# Altium project WR_NIC.PrjPcb (part 1 of 6)
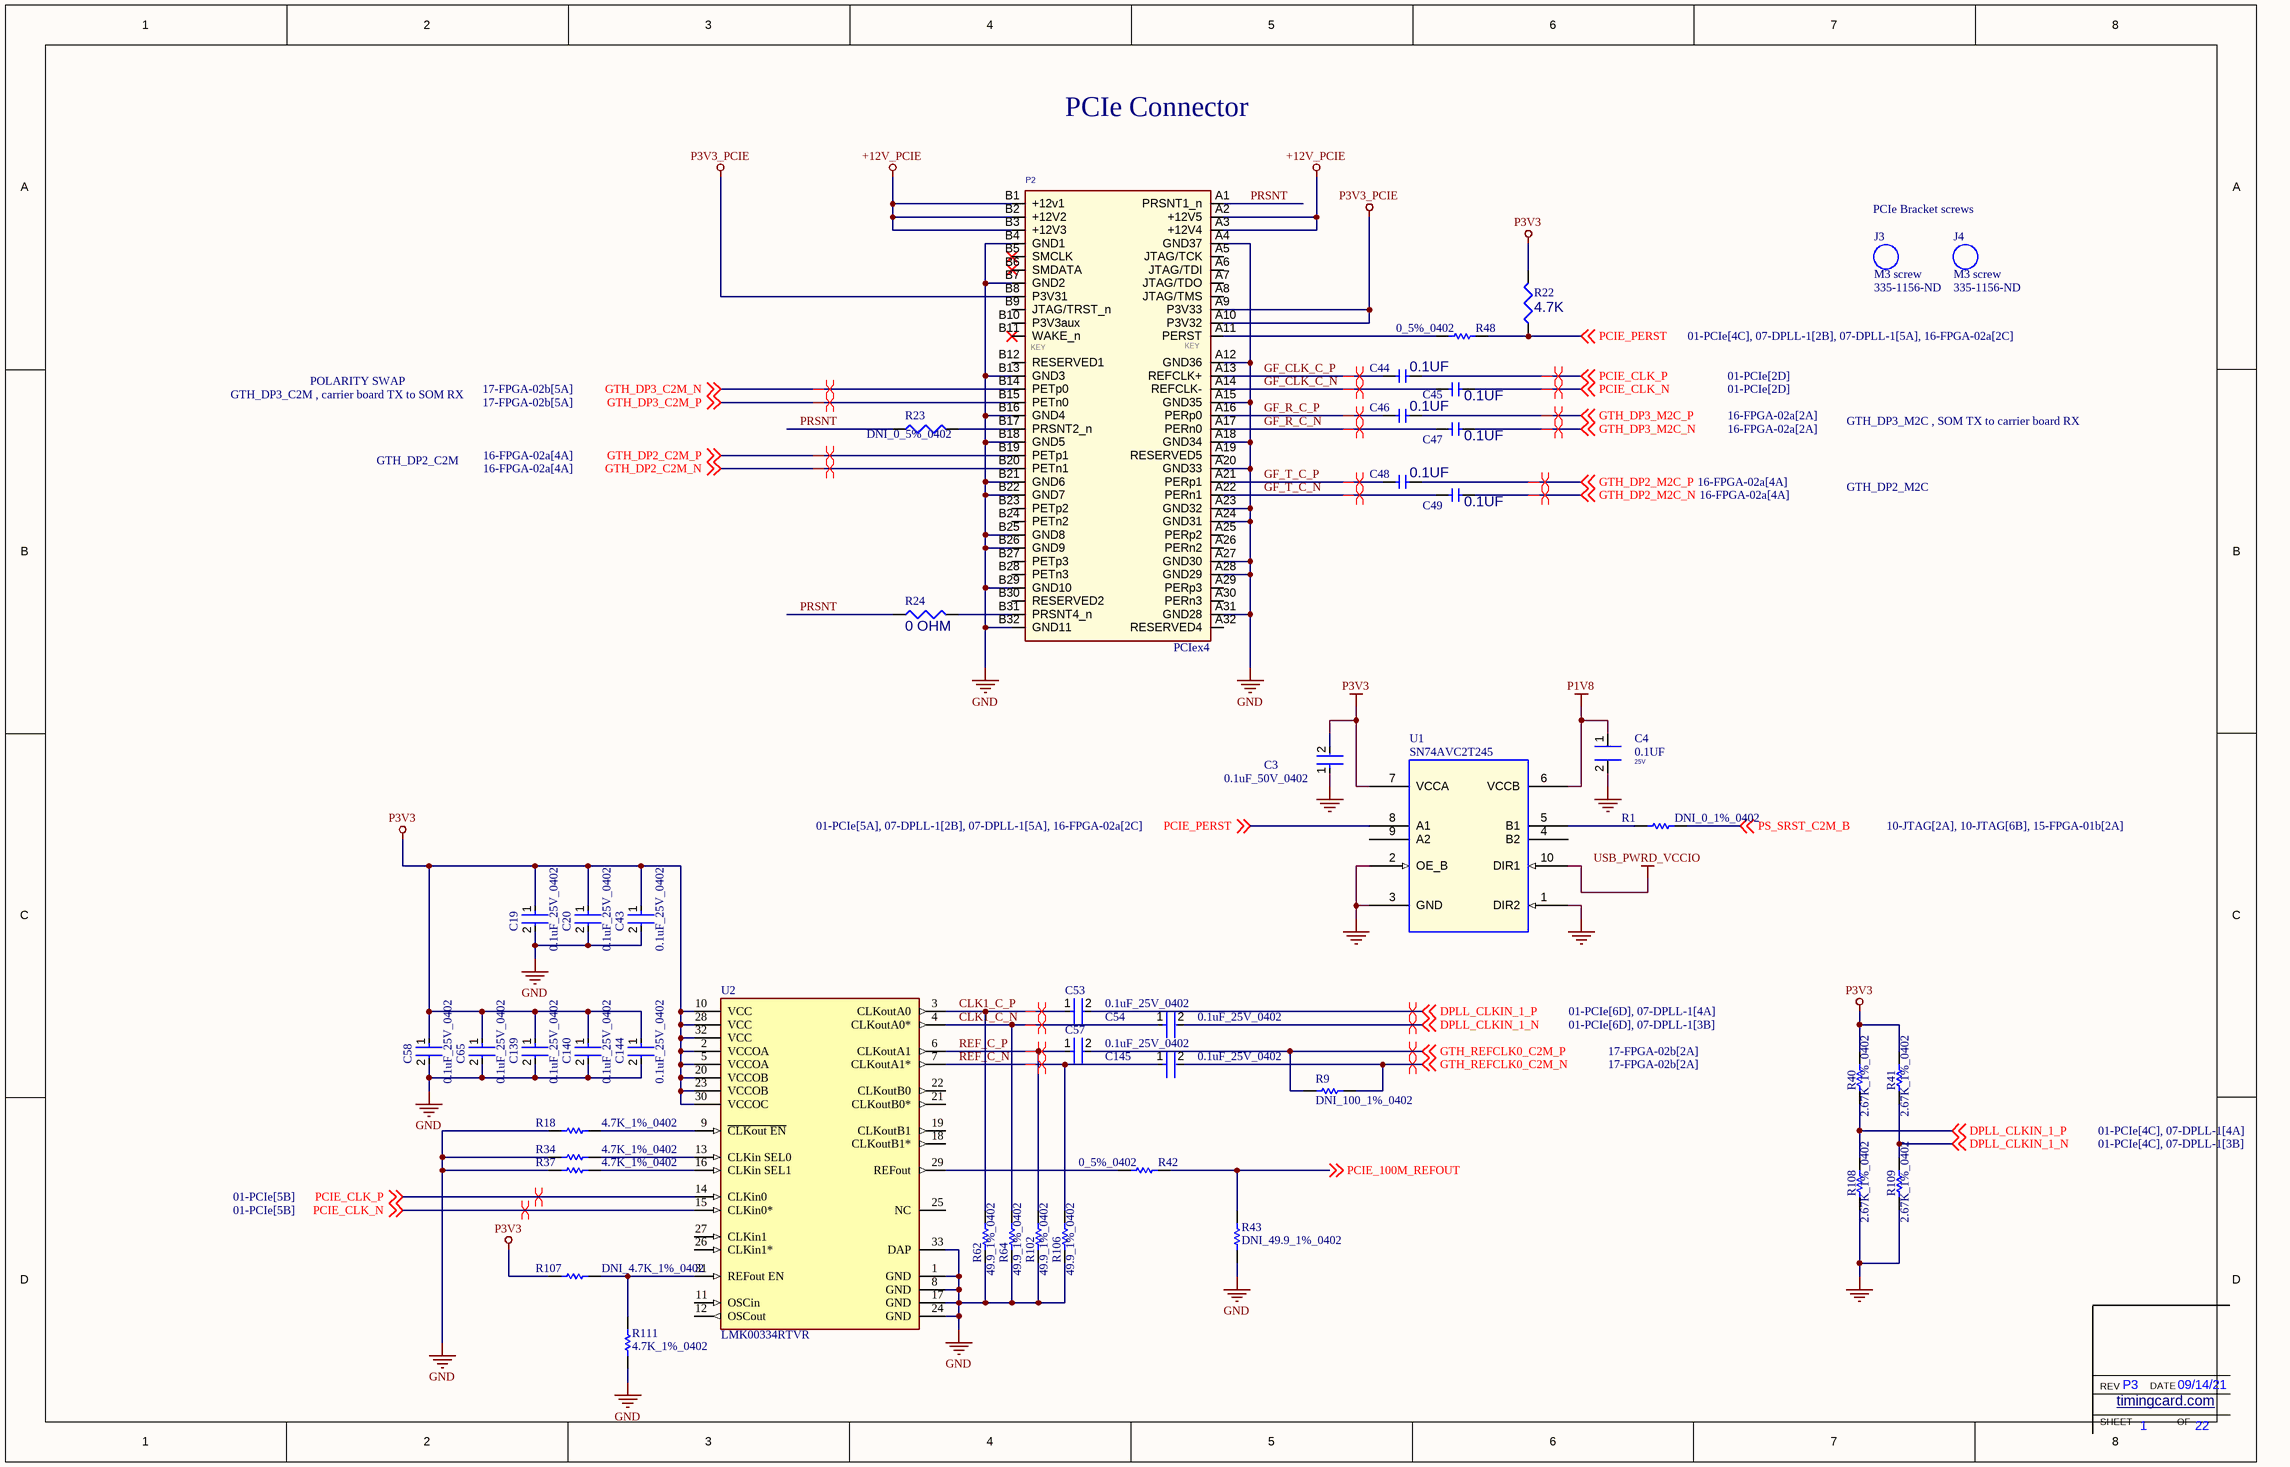
[diagram p0: 01-PCIe.SchDoc]
ProjectDate: 09/14/21; ProjectRevision: P3
22 sheets, 736 parts. Net scope: global (net labels, ports and power ports of the same name join across sheets).
Board file: WR_NIC_V2.PcbDoc
Sheets:
  01-PCIe.SchDoc
  02-USER_IO.SchDoc
  03-USER_IO_STATUS.SchDoc
  04-POWER-P12V.SchDoc
  05-Front Panel SFP+.SchDoc
  06-General I2C Devices.SchDoc
  07-DPLL-1.SchDoc
  08-DPLL-2.SchDoc
  09-DPLL-3.SchDoc
  10-JTAG.SchDoc
  11-DisplayPort.SchDoc
  12-USB Phy.SchDoc
  13-Experimental.SchDoc
  14-FPGA-01a.SchDoc
  15-FPGA-01b.SchDoc
  16-FPGA-02a.SchDoc
  17-FPGA-02b.SchDoc
  18-Power-P3V3.SchDoc
  19-Power-P5V.SchDoc
  20-Power-P1V8.SchDoc
  21-M2_GNSS.SchDoc
  22-1G_SFP.SchDoc

## Sheet 01-PCIe.SchDoc
size Tabloid; Customer: 01910; SheetNumber: 1; SheetTotal: 22

### Parts
C3  0.1uF_50V_0402  [FP-C1005-050-0_05-IPC_C]
C4  0.1UF  Voltage: 25V  [CAPC100X50X55]
C19  0.1uF_25V_0402  [FP-0402-L_1_0_1-W_0_5_0_1-IPC_C]
C20  0.1uF_25V_0402  [FP-0402-L_1_0_1-W_0_5_0_1-IPC_C]
C43  0.1uF_25V_0402  [FP-0402-L_1_0_1-W_0_5_0_1-IPC_C]
C44  value 0.1UF  [CAPC1005X06N]  (hidden comment: CAP_0402_0.1UF_50V)
C45  value 0.1UF  [CAPC1005X06N]  (hidden comment: CAP_0402_0.1UF_50V)
C46  value 0.1UF  [CAPC1005X06N]  (hidden comment: CAP_0402_0.1UF_50V)
C47  value 0.1UF  [CAPC1005X06N]  (hidden comment: CAP_0402_0.1UF_50V)
C48  value 0.1UF  [CAPC1005X06N]  (hidden comment: CAP_0402_0.1UF_50V)
C49  value 0.1UF  [CAPC1005X06N]  (hidden comment: CAP_0402_0.1UF_50V)
C53  0.1uF_25V_0402  [FP-0402-L_1_0_1-W_0_5_0_1-IPC_C]
C54  0.1uF_25V_0402  [FP-0402-L_1_0_1-W_0_5_0_1-IPC_C]
C57  0.1uF_25V_0402  [FP-0402-L_1_0_1-W_0_5_0_1-IPC_C]
C58  0.1uF_25V_0402  [FP-0402-L_1_0_1-W_0_5_0_1-IPC_C]
C65  0.1uF_25V_0402  [FP-0402-L_1_0_1-W_0_5_0_1-IPC_C]
C139  0.1uF_25V_0402  [FP-0402-L_1_0_1-W_0_5_0_1-IPC_C]
C140  0.1uF_25V_0402  [FP-0402-L_1_0_1-W_0_5_0_1-IPC_C]
C144  0.1uF_25V_0402  [FP-0402-L_1_0_1-W_0_5_0_1-IPC_C]
C145  0.1uF_25V_0402  [FP-0402-L_1_0_1-W_0_5_0_1-IPC_C]
J3  M3 screw  Supplier Part Number 1: 335-1156-ND
J4  M3 screw  Supplier Part Number 1: 335-1156-ND
P2  PCIex4  [PCIE_4LANE_EDGE]
R1  DNI_0_1%_0402  [RESC1005X40X25LL05T05]  (no BOM)
R9  DNI_100_1%_0402  [RESC1005X40X25ML05T10]  (no BOM)
R18  4.7K_1%_0402  [RESC1005X40X25NL10T10]
R22  value 4.7K  [RESC1608X50N]  (hidden comment: ERJ-3EKF4701V)
R23  DNI_0_5%_0402  [RESC1005X04N]  (no BOM)
R24  value 0 OHM  [RESC1005X04N]  (hidden comment: ERJ-2GE0R00X)
R34  4.7K_1%_0402  [RESC1005X40X25NL10T10]
R37  4.7K_1%_0402  [RESC1005X40X25NL10T10]
R40  2.67K_1%_0402  [RESC1005X40X25NL05T10]
R41  2.67K_1%_0402  [RESC1005X40X25NL05T10]
R42  0_5%_0402  [RESC1005X40X25LL10T10]
R43  DNI_49.9_1%_0402  [RESC1005X40X25NL10T10]  (no BOM)
R48  0_5%_0402  [RESC1005X40X25LL10T10]
R62  49.9_1%_0402  [RESC1005X40X25NL10T10]
R64  49.9_1%_0402  [RESC1005X40X25NL10T10]
R102  49.9_1%_0402  [RESC1005X40X25NL10T10]
R106  49.9_1%_0402  [RESC1005X40X25NL10T10]
R107  DNI_4.7K_1%_0402  [RESC1005X40X25NL10T10]  (no BOM)
R108  2.67K_1%_0402  [RESC1005X40X25NL05T10]
R109  2.67K_1%_0402  [RESC1005X40X25NL05T10]
R111  4.7K_1%_0402  [RESC1005X40X25NL10T10]
U1  SN74AVC2T245  [QFN40P140X180X55-10]
U2  LMK00334RTVR  [FP-RTV0032A-MFG]

### Nets
+12V_PCIE: P2.A2(+12V5) P2.A3(+12V4) P2.B1(+12v1) P2.B2(+12V2) P2.B3(+12V3)
GND: C3.1 C4.2 C19.2 C20.2 C43.2 C58.2 C65.2 C139.2 C140.2 C144.2 P2.A4(GND37) P2.A12(GND36) P2.A15(GND35) P2.A18(GND34) P2.A20(GND33) P2.A23(GND32) P2.A24(GND31) P2.A27(GND30) P2.A28(GND29) P2.A31(GND28) P2.B4(GND1) P2.B7(GND2) P2.B13(GND3) P2.B16(GND4) P2.B18(GND5) P2.B21(GND6) P2.B22(GND7) P2.B25(GND8) P2.B26(GND9) P2.B29(GND10) P2.B32(GND11) R18.2 R34.2 R37.2 R43.2 R62.1 R64.1 R102.1 R106.1 R108.1 R109.1 R111.2 U1.1(DIR2) U1.2(OE_B) U1.3(GND) U2.1(GND) U2.8(GND) U2.17(GND) U2.24(GND) U2.33(DAP)
P1V8: C4.1 U1.6(VCCB)
P3V3: C3.2 C19.1 C20.1 C43.1 C58.1 C65.1 C139.1 C140.1 C144.1 R22.2 R40.2 R41.2 R107.2 U1.7(VCCA) U2.2(VCCOA) U2.5(VCCOA) U2.10(VCC) U2.20(VCCOB) U2.23(VCCOB) U2.28(VCC) U2.30(VCCOC) U2.32(VCC)
P3V3_PCIE: P2.A9(P3V33) P2.A10(P3V32) P2.B8(P3V31)
USB_PWRD_VCCIO: U1.10(DIR1)
CLK1_C_N: C54.1 R64.2 U2.4(CLKoutA0*)
CLK1_C_P: C53.1 R62.2 U2.3(CLKoutA0)
DPLL_CLKIN_1_N: C54.2 R41.1 R109.2 ; off-sheet DPLL_CLKIN_1_N
DPLL_CLKIN_1_P: C53.2 R40.1 R108.2 ; off-sheet DPLL_CLKIN_1_P
GF_CLK_C_N: C45.1 P2.A14(REFCLK-)
GF_CLK_C_P: C44.1 P2.A13(REFCLK+)
GF_R_C_N: C47.1 P2.A17(PERn0)
GF_R_C_P: C46.1 P2.A16(PERp0)
GF_T_C_N: C49.1 P2.A22(PERn1)
GF_T_C_P: C48.1 P2.A21(PERp1)
GTH_DP2_C2M_N: P2.B20(PETn1) ; off-sheet GTH_DP2_C2M_N
GTH_DP2_C2M_P: P2.B19(PETp1) ; off-sheet GTH_DP2_C2M_P
GTH_DP2_M2C_N: C49.2 ; off-sheet GTH_DP2_M2C_N
GTH_DP2_M2C_P: C48.2 ; off-sheet GTH_DP2_M2C_P
GTH_DP3_C2M_N: P2.B14(PETp0) ; off-sheet GTH_DP3_C2M_N
GTH_DP3_C2M_P: P2.B15(PETn0) ; off-sheet GTH_DP3_C2M_P
GTH_DP3_M2C_N: C47.2 ; off-sheet GTH_DP3_M2C_N
GTH_DP3_M2C_P: C46.2 ; off-sheet GTH_DP3_M2C_P
GTH_REFCLK0_C2M_N: C145.2 R9.2 ; off-sheet GTH_REFCLK0_C2M_N
GTH_REFCLK0_C2M_P: C57.2 R9.1 ; off-sheet GTH_REFCLK0_C2M_P
PCIE_100M_REFOUT: R42.2 R43.1 ; off-sheet PCIE_100M_REFOUT
PCIE_CLK_N: C45.2 U2.15(CLKin0*) ; off-sheet PCIE_CLK_N
PCIE_CLK_P: C44.2 U2.14(CLKin0) ; off-sheet PCIE_CLK_P
PCIE_PERST: R22.1 R48.2 U1.8(A1) ; off-sheet PCIE_PERST
PRSNT: P2.A1(PRSNT1_n) R23.1 R24.1
PS_SRST_C2M_B: R1.2 ; off-sheet PS_SRST_C2M_B
REF_C_N: C145.1 R106.2 U2.7(CLKoutA1*)
REF_C_P: C57.1 R102.2 U2.6(CLKoutA1)
NetP2_A11: P2.A11(PERST) R48.1
NetP2_B17: P2.B17(PRSNT2_n) R23.2
NetP2_B31: P2.B31(PRSNT4_n) R24.2
NetR1_1: R1.1 U1.5(B1)
NetR18_1: R18.1 U2.9(~{CLKout_EN})
NetR34_1: R34.1 U2.13(CLKin_SEL0)
NetR37_1: R37.1 U2.16(CLKin_SEL1)
NetR42_1: R42.1 U2.29(REFout)
NetR107_1: R107.1 R111.1 U2.31(REFout_EN)

Not connected (* = marked no-connect by the designer): P2 A5(JTAG/TCK) A6(JTAG/TDI) A7(JTAG/TDO) A8(JTAG/TMS) A19(RESERVED5) A25(PERp2) A26(PERn2) A29(PERp3) A30(PERn3) A32(RESERVED4) B5(SMCLK)* B6(SMDATA)* B9(JTAG/TRST_n) B10(P3V3aux) B11(WAKE_n)* B12(RESERVED1) B23(PETp2) B24(PETn2) B27(PETp3) B28(PETn3) B30(RESERVED2); U1 4(B2) 9(A2); U2 11(OSCin) 12(OSCout) 18(CLKoutB1*) 19(CLKoutB1) 21(CLKoutB0*) 22(CLKoutB0) 25(NC) 26(CLKin1*) 27(CLKin1)

### Layout directives
differential pair: CLK1_C_N, CLK1_C_P, DPLL_CLKIN_1_N, DPLL_CLKIN_1_P, GF_CLK_C_N, GF_CLK_C_P, GF_R_C_N, GF_R_C_P, GF_T_C_N, GF_T_C_P, GTH_DP2_C2M_N, GTH_DP2_C2M_P, GTH_DP2_M2C_N, GTH_DP2_M2C_P, GTH_DP3_C2M_N, GTH_DP3_C2M_P, GTH_DP3_M2C_N, GTH_DP3_M2C_P, GTH_REFCLK0_C2M_N, GTH_REFCLK0_C2M_P, PCIE_CLK_N, PCIE_CLK_P, REF_C_N, REF_C_P

### Notes on the sheet
- PCIe Connector
- PCIe Bracket screws
- GTH_DP3_C2M , carrier board TX to SOM RX
- POLARITY SWAP
- GTH_DP3_M2C , SOM TX to carrier board RX
- GTH_DP2_C2M
- GTH_DP2_M2C
- SHEET
- REV
- timingcard.com <http://timingcard.com>
- DATE
- OF
- (in symbol PCIex4) KEY

### Library data of the parts
C3 = CMP-2000-05393-2: Multilayer Ceramic Capacitors 100nF ±10% 50V X7R SMD 0402; Voltage: 50V; Dielectric Material: Ceramic; Min Operating Temperature: -55°C; Depth: 0.5mm; Radiation Hardening: No; RoHS Compliant: Yes; Voltage Rating (DC): 50V; Lead Free: Lead Free; Resistor Type: Ceramic; Height: 0.5mm; Dielectric: X7R; Thickness: 0.022inch; Case/Package: 0402; Case Code (Metric): 1005; Termination: SMD/SMT; Capacitance: 100nF; Packaging: Tape and Reel; Max Operating Temperature: 125°C; Mount: Surface Mount; Package Quantity: 1; Width: 0.02inch; Weight: 2.3E-05oz; Voltage Rating: 50V; Tolerance: 10%; Construction: Flat; Case Code (Imperial): 0402; Length: 1mm; REACH SVHC: No SVHC; Series: C
C4 = CAP_NP: Cap Cer 100nF 10% 25V X5R 0402; Manufacturer PN: TMK105BJ104KV-F; Manufacturer: TAIYO YUDEN; Agile Part Number: CAP-00068-01; barcode: 100040; OWNER: 4001; ALT_SYMBOLS: CAPC100X50X55RND; PCB Footprint: CAPC100X50X55; PartType: CERAMIC; ROHS: Yes; PRICE: 0.01; Part Type: CERAMIC; Dielectric Type: X5R; CIP Link: http://xsjbrdwin1/CIP-E/Component/Index/All?pn=100040; Tolerance: 10%
C19 C20 C43 C53 C54 C57 C58 C65 C139 C140 C144 C145 = CMP-2008-02519-2: General Purpose Ceramic Capacitor, 0402, 100nF, 10%, X7R, 15%, 25V; Package Quantity: 1; Capacitance: 100nF; Min Operating Temperature: -55°C; Voltage: 25V; Voltage Rating: 25V; Construction: Flat; Max Operating Temperature: 125°C; Radiation Hardening: No; Depth: 0.5mm; Thickness: 0.022inch; Voltage Rating (DC): 25V; Number of Pins: 2; Lead Free: Lead Free; Series: -; REACH SVHC: No SVHC; Length: 1mm; Dielectric: X7R; RoHS Compliant: Yes; Mount: Surface Mount; Packaging: Tape and Reel; Case/Package: 0402; Case Code (Imperial): 0402; Termination: SMD/SMT; Width: 0.02inch; Case Code (Metric): 1005; Tolerance: 10%
C44-C49 = CAP_0402_0.1UF_50V: CAP, CER, 0.1UF, 50V, 10%, X7R, AEC-Q200, 0402; MFG PART NUM: CGA2B3X7R1H104K050BB; VALENTIUM PART NUM: <VALENTIUM>; MFG NAME: TDK; MAXTEMP: 125C; MINTEMP: -55C; CATEGORY: CAP, CER; MODIFY DATE: 10/23/2013; SHEETPART: *; P1: 10%; OTHER: AEC-Q200; P2: 50V; P3: X7R; Size: 0402; DESC: CAP, CER, 0.1UF, 50V, 10%, X7R, AEC-Q200, 0402; Supplier 1: Digi-Key; Supplier Part Number 1: 445-6899-1-ND
P2 = PCIex4: PCIE x4 Edge Connector,OrCAD Symbol,NC; Part Number: 451; Manufacturer: NA; NOTE: NC; Vendor P/N: NA; Part Type: SMT
R1 = CMP-2000-07451-1: Chip Resistor, 0 Ohm, 0.1 W, -55 to 155 degC, 0402 (1005 Metric), RoHS, Tape and Reel; Manufacturer: Panasonic; Voltage Rating (DC): 50V; Temperature Coefficient: 600ppm/��C; Max Power Dissipation: 100mW; Resistance: 0mOhm; Tolerance: 5%; Number of Terminations: 2; Mount: SurfaceMount; Height: 0.35mm; Packaging: TapeandReel; Contact Plating: Tin; Manufacturer URL: http://www.panasonic.com/; Composition: ThickFilm; Max Operating Temperature: 155degC; REACH SVHC: NoSVHC; Case/Package: 0402; Package Reference: 402; Depth: 0.5mm; Package Description: 2-Pin Surface Mount Device, Body 1 x 0.5 mm; Datasheet URL: https://industrial.panasonic.com/cdbs/www-data/pdf/RDA0000/AOA0000C301.pdf; RoHSCompliant: True; Case Code (Imperial): 0402; Military Standard: Not; Min Operating Temperature: -55degC; Power Rating: 100mW; Datasheet Version: 03/2015; Length: 1mm; Case Code (Metric): 1005; Termination: SMD/SMT; Mounting Technology: SurfaceMount; Voltage Rating: 50V; Width: 0.02inch; Package Quantity: 1; Lead Free: LeadFree; Radiation Hardening: No
R9 = CMP-2002-06458-1: Part Number: ERJ-U02F1000X; Manufacturer: Panasonic
R18 R34 R37 R107 R111 = CMP-2002-05217-1: Manufacturer: Bourns; Part Number: CR0402-FX-4701GLF
R22 = RES_0603_4.7K: RES, 4.7K, 1%, 1/10W, TF, 0603; VELENTIUM PART NUM: <VELENTIUM>; MFG NAME: PANASONIC; MAXTEMP: 125C; MINTEMP: -55C; OTHER: 100PPM; SUB: GENERIC; ModifyDate: 7/25/2013; MFG PART NUM: ERJ-3EKF4701V; CATEGORY: RES; Date: 7/26/2013; P1: 1%; P3: TF; P2: 1/10W; SIZE: 0603; Supplier 1: Digi-Key; Supplier Part Number 1: P4.70KHCT-ND; SHEETPART: *; DESC: RES, 4.7K, 1%, 1/10W, TF, 0603
R23 = RES_0402_0: RES, 0. OHM, 1%, 1/16W, TF, AEC-Q200, 0402; MFG PART NUM: ERJ-2GE0R00X; VELENTIUM PART NUM: <VELENTIUM>; MFG NAME: PANASONIC; MAXTEMP: 155C; MINTEMP: -55C; OTHER: 100PPM, AEC-Q200; SUB: GENERIC; DESC: RES, 0 OHM, 1%, 1/16W, TF, AEC-Q200, 0402; VALUE: 0 OHM; ModifyDate: 7/25/2013; CATEGORY: RES; Date: 7/26/2013; P1: 1%; P3: TF; P2: 1/16W; SIZE: 0402; SHEETPART: *; Supplier 1: Digi-Key; Supplier Part Number 1: P0.0JCT-ND
R24 = RES_0402_0: RES, 0. OHM, 1%, 1/16W, TF, AEC-Q200, 0402; VELENTIUM PART NUM: <VELENTIUM>; MFG NAME: PANASONIC; MAXTEMP: 155C; MINTEMP: -55C; OTHER: 100PPM, AEC-Q200; SUB: GENERIC; DESC: RES, 0 OHM, 1%, 1/16W, TF, AEC-Q200, 0402; ModifyDate: 7/25/2013; MFG PART NUM: ERJ-2GE0R00X; CATEGORY: RES; Date: 7/26/2013; P1: 1%; P3: TF; P2: 1/16W; SIZE: 0402; SHEETPART: *; Supplier 1: Digi-Key; Supplier Part Number 1: P0.0JCT-ND
R40 R41 R108 R109 = CMP-2002-07574-1: Manufacturer: Yageo; Part Number: RC0402FR-072K67L
R42 R48 = CMP-2002-04569-1: Manufacturer: KOA Speer; Part Number: RK73Z1ETTP
R43 R62 R64 R102 R106 = CMP-2002-04448-1: Part Number: RK73H1ETTP49R9F; Manufacturer: KOA Speer
U1 = SN74AVC2T245: IC Lvl Trans 2-Bit Bidir 500Mbps 1.2-3.6V 50mA UQFN-10; Manufacturer PN: SN74AVC2T245RSWR; Manufacturer: TEXAS INSTRUMENTS; Agile Part Number: ICS-00048-01; EDMVersionID: 493023062; Barcode: 500012; PCB Footprint: QFN40P140X180X55-10; Part Type: BUS TRANSCEIVER; CIP Link: http://xsjbrdwin1/CIP-E/Component/Index/All?pn=500012
U2 = CMP-04855-000011-1: IC CLK BUF 400MHZ 1CIRC 32WQFN; Number of Outputs: 4; Max Supply Voltage: 3.45V; PLL: No; Max Duty Cycle: 55%; Operating Supply Current: 13.5mA; Min Supply Voltage: 3.15V; Nominal Supply Current: 8.5mA; Input: Crystal; Propagation Delay: 2700ps; Operating Supply Voltage: 3.3V; Number of Circuits: 1; REACH SVHC: No SVHC; Radiation Hardening: No; RoHS Compliant: Yes; Lead Free: Lead Free; Mount: Surface Mount; Min Operating Temperature: -40°C; Package Quantity: 1000; Max Operating Temperature: 85°C; Number of Pins: 32; Max Frequency: 400MHz; Frequency: 400MHz; Packaging: Tape and Reel
J3 J4 = M3 screw: Supplier 1: Digi-Key

## Sheet 02-USER_IO.SchDoc
size Tabloid; DocumentNumber: 1; SheetNumber: 2; SheetTotal: 22
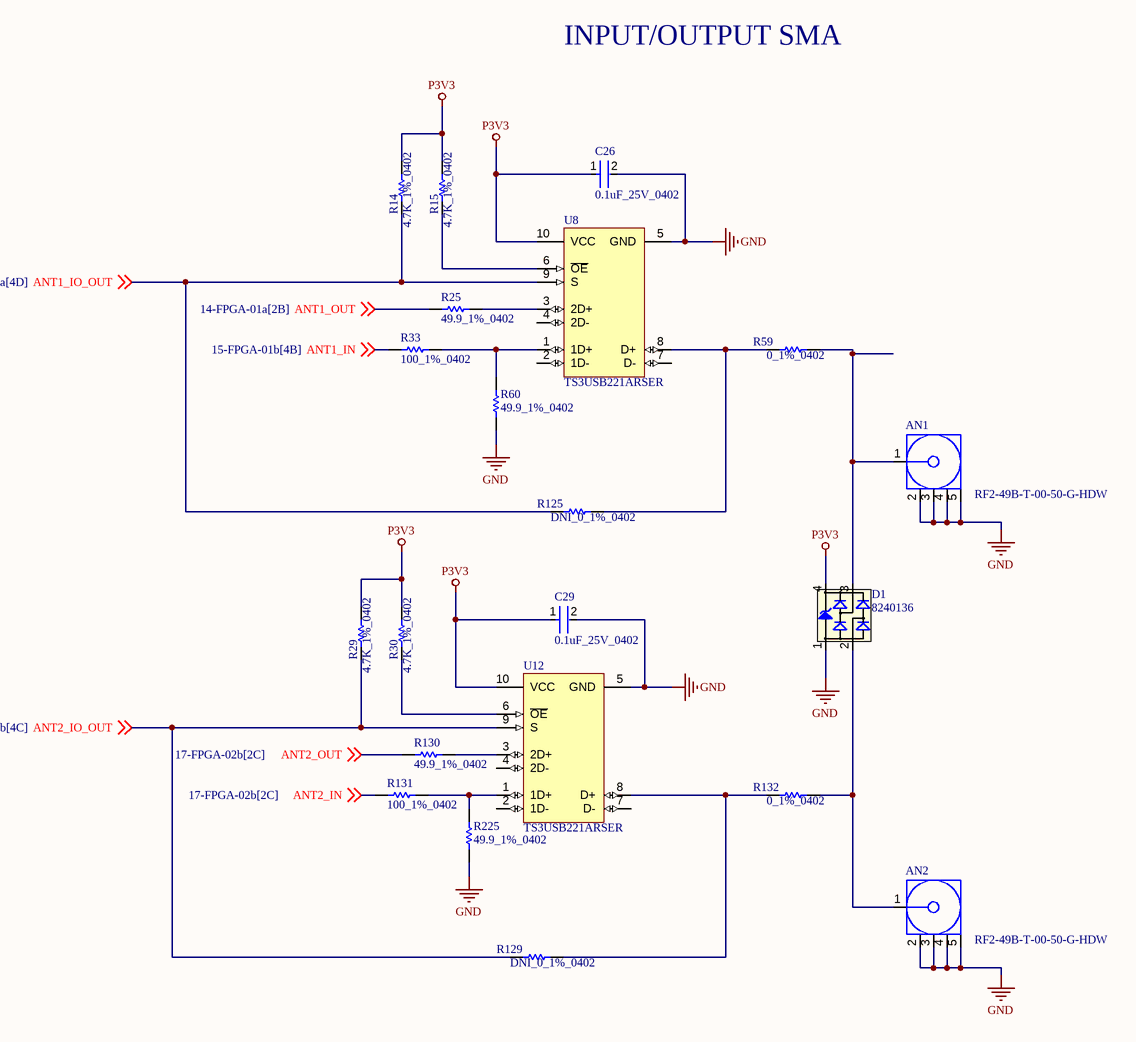
[diagram p1: 02-USER_IO.SchDoc]

### Parts
AN1  RF2-49B-T-00-50-G-HDW  [AMPH-901-143-6RFX_V]
AN2  RF2-49B-T-00-50-G-HDW  [AMPH-901-143-6RFX_V]
C26  0.1uF_25V_0402  [FP-0402-L_1_0_1-W_0_5_0_1-IPC_C]
C29  0.1uF_25V_0402  [FP-0402-L_1_0_1-W_0_5_0_1-IPC_C]
D1  8240136  [SOT143-4L]
R14  4.7K_1%_0402  [RESC1005X40X25NL10T10]
R15  4.7K_1%_0402  [RESC1005X40X25NL10T10]
R25  49.9_1%_0402  [RESC1005X40X25NL10T10]
R29  4.7K_1%_0402  [RESC1005X40X25NL10T10]
R30  4.7K_1%_0402  [RESC1005X40X25NL10T10]
R33  100_1%_0402  [RESC1005X40X25NL05T10]
R59  0_1%_0402  [RESC1005X40X25LL05T05]
R60  49.9_1%_0402  [RESC1005X40X25NL10T10]
R125  DNI_0_1%_0402  [RESC1005X40X25LL05T05]  (no BOM)
R129  DNI_0_1%_0402  [RESC1005X40X25LL05T05]  (no BOM)
R130  49.9_1%_0402  [RESC1005X40X25NL10T10]
R131  100_1%_0402  [RESC1005X40X25NL05T10]
R132  0_1%_0402  [RESC1005X40X25LL05T05]
R225  49.9_1%_0402  [RESC1005X40X25NL10T10]
U8  TS3USB221ARSER  [RSE0010A_V]
U12  TS3USB221ARSER  [RSE0010A_V]

### Nets
GND: AN1.2 AN1.3 AN1.4 AN1.5 AN2.2 AN2.3 AN2.4 AN2.5 C26.2 C29.2 D1.1(GND) R60.1 R225.1 U8.5(GND) U12.5(GND)
P3V3: C26.1 C29.1 D1.4(VDD) R14.1 R15.1 R29.1 R30.1 U8.10(VCC) U12.10(VCC)
ANT1_IN: R33.1 ; off-sheet ANT1_IN
ANT1_IO_OUT: R14.2 R125.1 U8.9(S) ; off-sheet ANT1_IO_OUT
ANT1_OUT: R25.1 ; off-sheet ANT1_OUT
ANT2_IN: R131.1 ; off-sheet ANT2_IN
ANT2_IO_OUT: R29.2 R129.1 U12.9(S) ; off-sheet ANT2_IO_OUT
ANT2_OUT: R130.1 ; off-sheet ANT2_OUT
NetAN1_1: AN1.1 D1.3(I/O2) R59.2
NetAN2_1: AN2.1 D1.2(I/O1) R132.2
NetR15_2: R15.2 U8.6(~{OE})
NetR25_2: R25.2 U8.3(2D+)
NetR30_2: R30.2 U12.6(~{OE})
NetR33_2: R33.2 R60.2 U8.1(1D+)
NetR59_1: R59.1 R125.2 U8.8(D+)
NetR129_2: R129.2 R132.1 U12.8(D+)
NetR130_2: R130.2 U12.3(2D+)
NetR131_2: R131.2 R225.2 U12.1(1D+)

Not connected (* = marked no-connect by the designer): U8 2(1D-) 4(2D-) 7(D-); U12 2(1D-) 4(2D-) 7(D-)

### Notes on the sheet
- INPUT/OUTPUT SMA
- SHEET
- REV
- timingcard.com <http://timingcard.com>
- DATE
- OF

### Library data of the parts
AN1 AN2 = CMP-2000-05705-1: Coaxial connector, 50 Ohm, -65 to 165 degC, 5-Pin THD, RoHS, Bulk; Manufacturer: Amphenol; Catalog Drawings: 901-143-6RFXMountingHole; 3D Model: 901-143-6RFX.igs; Body Material: Brass; Connector Type: Jack,FemaleSocket; Shield Termination: Solder; Other Names: 901-143-6-RFX9011436RFXARFX1232; Online Catalog: SMA,RFX; Frequency - Max: 18GHz; Body Finish: Gold; Dielectric Material: Polytetrafluoroethylene(PTFE); Center Contact Material: BerylliumCopper; Impedance: 50Ohm; Connector Style: SMA; Mounting Technology: ThroughHole; Mounting Type: ThroughHole,RightAngle; Cable Group: -; Series: -; Package Description: 5-Pin Through Hole Device, Body 7 x 7 mm, Pitch 2.54 mm; Package Reference: 901-143-6RFX; Voltage Rating: -; Standard Package: 1; Fastening Type: Threaded; Housing Color: Gold; Datasheet URL: http://www.amphenolrf.com/downloads/dl/file/id/2712/product/3102/901_143_6rfx_customer_drawing.pdf; Family: CoaxialConnectors(RF); Contact Termination: Solder; Manufacturer URL: http://www.amphenol.com/; Operating Temperature: -65°C~165°C; Category: Connectors,Interconnects; Packaging: Bulk; Features: -; Center Contact Plating: Gold; Datasheet Version: Rev. C, 06/2010; Ingress Protection: -
C26 C29 = CMP-2008-02519-2: as C19 on sheet 01-PCIe; Package Quantity: 1; Capacitance: 100nF; Min Operating Temperature: -55°C; Voltage: 25V; Voltage Rating: 25V; Construction: Flat; Max Operating Temperature: 125°C; Radiation Hardening: No; Depth: 0.5mm; Thickness: 0.022inch; Voltage Rating (DC): 25V; Number of Pins: 2; Lead Free: Lead Free; Series: -; REACH SVHC: No SVHC; Length: 1mm; Dielectric: X7R; RoHS Compliant: Yes; Mount: Surface Mount; Packaging: Tape and Reel; Case/Package: 0402; Case Code (Imperial): 0402; Termination: SMD/SMT; Width: 0.02inch; Case Code (Metric): 1005; Tolerance: 10%
D1 = CMP-1486-00002-1: TVS Diode WE-TVS-HS, VRWM=3.3V; Manufacturer: Wuerth Elektronik; Reverse Stand Off Voltage: 3.3V; PartNumber: 8240136; ComponentLink1Description: Manufacturer URL; PackageReference: SOT143-4L; ComponentLink1URL: http://www.we-online.com; ComponentLink2Description: Datasheet; ComponentLink2URL: http://katalog.we-online.de/kataloge/eisos/media/pdf/8240136.pdf
R14 R15 R29 R30 = CMP-2002-05217-1: as R18 on sheet 01-PCIe
R25 R60 R130 R225 = CMP-2002-04448-1: as R43 on sheet 01-PCIe
R33 R131 = CMP-2002-07853-1: Manufacturer: Yageo; Part Number: RC0402FR-13100RL
R59 R125 R129 R132 = CMP-2000-07451-1: as R1 on sheet 01-PCIe; Number of Terminations: 2; Mount: SurfaceMount; Height: 0.35mm; Packaging: TapeandReel; Contact Plating: Tin; Manufacturer URL: http://www.panasonic.com/; Composition: ThickFilm; Max Operating Temperature: 155degC; REACH SVHC: NoSVHC; Case/Package: 0402; Package Reference: 402; Depth: 0.5mm; Package Description: 2-Pin Surface Mount Device, Body 1 x 0.5 mm; Datasheet URL: https://industrial.panasonic.com/cdbs/www-data/pdf/RDA0000/AOA0000C301.pdf; RoHSCompliant: True; Case Code (Imperial): 0402; Military Standard: Not; Min Operating Temperature: -55degC; Power Rating: 100mW; Datasheet Version: 03/2015; Length: 1mm; Case Code (Metric): 1005; Termination: SMD/SMT; Mounting Technology: SurfaceMount; Voltage Rating: 50V; Width: 0.02inch; Package Quantity: 1; Lead Free: LeadFree; Radiation Hardening: No
U8 U12 = CMP-0309-00017-2: ESD Protected,High-Speed USB 2.0 (480-Mbps) 1:2 Multiplexer / Demultiplexer Switch, 1:2 Mux / Demux, 6 ohm RON, 2.5 to 3.3V, -40 to 85 degC, 10-Pin UQFN (RSE), Green (RoHS & no Sb/Br); Manufacturer: Texas Instruments; tpd max(ns): 0.25; RON Mis-match(Max)(Ohms): 0.2; OFF Time(Max)(ns): 12; Architecture: "1","2 mux/demux"; IL OFF(Max)(nA): 2; SubFamily: USB Switch; ESD HBM(kV): +/-7; ron(max)(ohms): 6; ON Time(Max)(ns): 30; Bandwidth(MHz): 900; RON Flatness(Max)(Ohms): 1; Vcc range(V): 2.3 to 3.6; Mounting Technology: Surface Mount; ComponentLink2URL: http://www.ti.com/lit/ml/mpqf186c/mpqf186c.pdf; PackageDescription: 10-Leads Plastic Quad Flatpack No-Lead, 2 x 1.5 x 0.55 mm Body, 0.5 mm Pitch; ComponentLink1URL: http://www.ti.com/general/docs/lit/getliterature.tsp?genericPartNumber=TS3USB221A&fileType=pdf; PackageReference: RSE0010A; ComponentLink2Description: Package Specification; PartNumber: TS3USB221ARSER; Code_JEDEC: MO-288-UEFD; DatasheetVersion: SCDS277; ComponentLink1Description: Datasheet; Eco-Plan: Green (RoHS & no Sb/Br); Number of Channels: 2; PackageVersion: revD, Jan-2011; ICC(uA): 30

## Sheet 03-USER_IO_STATUS.SchDoc: Time Card
size B; SheetNumber: 3; SheetTotal: 21; ENG_APP_DATE: --/--/--; DSN_APP_DATE: --/--/--; CHK_APP_DATE: --/--/--
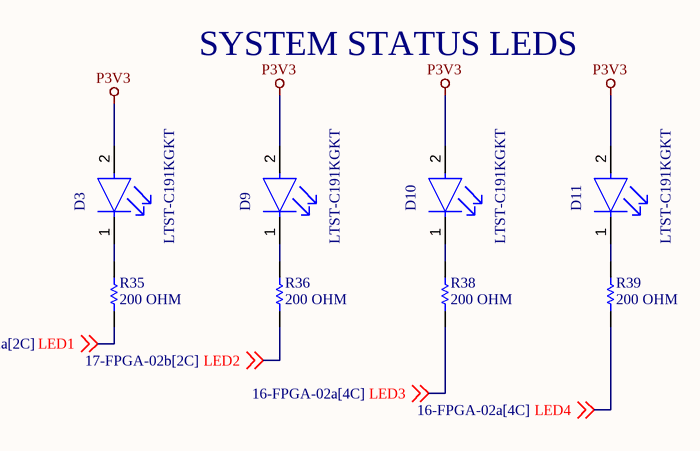
[diagram p2: 03-USER_IO_STATUS.SchDoc]

### Parts
D3  LTST-C191KGKT  [FP-LTST-C191KGKT-MFG]
D9  LTST-C191KGKT  [FP-LTST-C191KGKT-MFG]
D10  LTST-C191KGKT  [FP-LTST-C191KGKT-MFG]
D11  LTST-C191KGKT  [FP-LTST-C191KGKT-MFG]
R35  200 OHM  [RESC1608X55X30NL15T15]
R36  200 OHM  [RESC1608X55X30NL15T15]
R38  200 OHM  [RESC1608X55X30NL15T15]
R39  200 OHM  [RESC1608X55X30NL15T15]

### Nets
P3V3: D3.2(A) D9.2(A) D10.2(A) D11.2(A)
LED1: R35.1 ; off-sheet LED1
LED2: R36.1 ; off-sheet LED2
LED3: R38.1 ; off-sheet LED3
LED4: R39.1 ; off-sheet LED4
NetD3_1: D3.1(C) R35.2
NetD9_1: D9.1(C) R36.2
NetD10_1: D10.1(C) R38.2
NetD11_1: D11.1(C) R39.2

### Notes on the sheet
- SYSTEM STATUS LEDS
- DWG. NO.
- REV.
- SHT.
- THIS DOCUMENT AND THE DATA DISCLOSED HEREIN OR HEREWITH IS THE PROPERTY OF ALTIUM LIMITED AND MAY BE FREELY DISTRIBUTED IN WHOLE. NO RIGHTS ARE RESERVED OR EXPRESS OR IMPLIED WARANTEE GIVEN.
- REVISION
- DESCRIPTION
- DATE
- APPROVED
- ENG:
- APPROVALS
- PROJECT
- DSN:
- CHK:
- REFERENCE DOCUMENTS
- PROJECT REVISION:
- TITLE
- DOCUMENT REVISION:
- DESIGN ITEM:
- BOM:
- FAB DWG:
- PCB DWG:
- ASSY DWG:
- SCALE:
- SIZE
- B
- CAGE CODE
- FILE NAME
- DWG NO.
- SHEET
- OF
- REV

### Library data of the parts
D3 D9-D11 = CMP-2000-05198-2: LED GREEN CLEAR SMD; Max Power Dissipation: 75mW; Forward Current: 30mA; Reverse Voltage: 5V; Lens Color: Colorless; Forward Voltage: 2V; Dominant Wavelength: 571nm; Number of LEDs: 1; Viewing Angle: 130°; Lens Style: Rectangular; Test Current: 20mA; Luminous Intensity: 35mcd; Wavelength: 574nm; Width: 0.8mm; Case Code (Imperial): 0603; Number of Pins: 2; Lead Free: Lead Free; Packaging: Tape and Reel; Package Quantity: 1; Min Operating Temperature: -55°C; Case/Package: 0603; Length: 1.6mm; Power Dissipation: 75mW; Depth: 0.8mm; Radiation Hardening: No; Mount: Surface Mount; Max Operating Temperature: 85°C; Color: Green; Power Rating: 75mW; Height: 0.55mm; Illumination Color: Green; Case Code (Metric): 1608; Lens Transparency: Clear; Number of Elements: 1
R35 R36 R38 R39 = CMP-2000-00316-1: ERJ-3EKF2000V; Manufacturer: Panasonic; Part Number: ERJ-3EKF2000V

## Sheet 04-POWER-P12V.SchDoc
size Tabloid; Customer: 01910; SPICEModelCache: <root> / <DocumentId>GNEMVTBT</DocumentId> / </root>; SheetNumber: 4; SheetTotal: 20
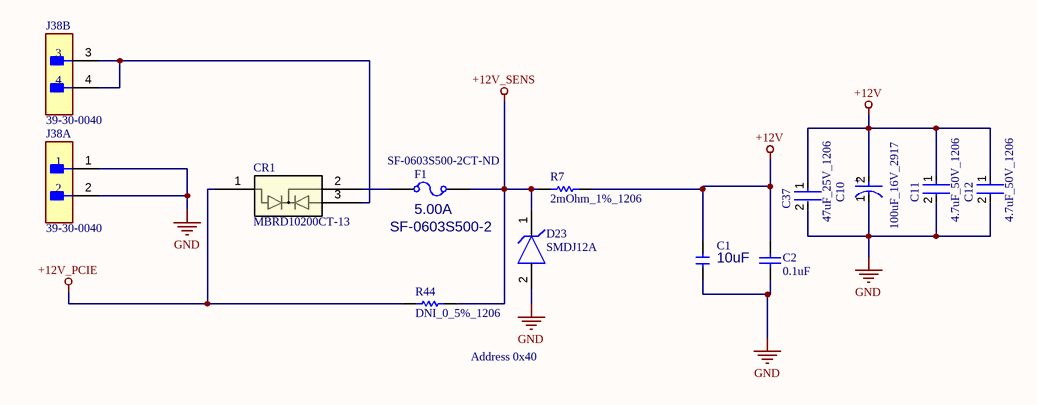
[diagram p3: 04-POWER-P12V.SchDoc]

### Parts
C1  value 10uF  [CAPC2012X14N]  (hidden comment: CAP_0805_10UF_25V)
C2  0.1uF  [CAPC1608X87X45ML20T05]
C10  100uF_16V_2917  [FP-T495D107K016ATE125-MFG]
C11  4.7uF_50V_1206  [FP-GRM31C-0_2-e0_3_0_8-IPC_C]
C12  4.7uF_50V_1206  [FP-GRM31C-0_2-e0_3_0_8-IPC_C]
C37  47uF_25V_1206  [FP-C3216-160-0_2-MFG]
CR1  MBRD10200CT-13  [TO252(DPAK)_DIO]
D23  SMDJ12A  [FP-DO-214AB_SMC_J-Bend-MFG]
F1  value 5.00A  MFG PART NUM: SF-0603S500-2  Supplier Part Number 1: SF-0603S500-2CT-ND  [FUSM1608X60N]  (hidden comment: FUSE_0603_5.00A)
J38  39-30-0040  [FP-39-30-0040-MFG]  (parts A,B of 2)
R7  2mOhm_1%_1206  [RESC3216X89X64NL25T25]
R44  DNI_0_5%_1206  [RESC3116X65X50ML20T20]  (no BOM)

### Nets
+12V: C1.1 C2.2 C10.2(A) C11.1 C12.1 C37.1 R7.2
+12V_PCIE: CR1.1 R44.1
+12V_SENS: D23.1(C) F1.2 R7.1 R44.2
GND: C1.2 C2.1 C10.1(C) C11.2 C12.2 C37.2 D23.2(A) J38.1 J38.2
NetCR1_2: CR1.2 F1.1
NetCR1_3: CR1.3 J38.3 J38.4

### Notes on the sheet
- Address 0x40
- SHEET
- REV
- timingcard.com <http://timingcard.com>
- DATE
- OF
- (in symbol CMP-2000-07207-2) +

### Library data of the parts
C1 = CAP_0805_10UF_25V: CAP, CER, 10.UF, 25V, 10%, X5R, 0805; MFG PART NUM: TMK212BBJ106KG-T; VALENTIUM PART NUM: <VALENTIUM>; MFG NAME: TAIYO YUDEN; MAXTEMP: 85C; MINTEMP: -55C; DESC: CAP, CER, 10.UF, 10V, 10%, X5R, 0805; MODIFY DATE: 10/23/2013; CATEGORY: CAP, CER; Date: 4/11/2006 3:37:28 PM; SHEETPART: *; P1: 10%; P2: 25V; P3: X5R; Size: 0805; Supplier 1: MOUSER; Supplier Part Number 1: 963-TMK212BBJ106KG-T
C2 = CMP-2006-00003-1: C0603X104K5RACAUTO; Manufacturer: Kemet; Part Number: C0603X104K5RACAUTO
C10 = CMP-2000-07207-2: CAP TANT 100UF 10% 16V 2917; Life (Hours): 2000Hour; ESR (Equivalent Series Resistance): 125mR; Polarity: Polar; Dielectric Material: Tantalum; Dissipation Factor: 8%; Capacitance: 100uF; Radiation Hardening: No; RoHS Compliant: Yes; Length: 7.3mm; Features: General Purpose; Packaging: Tape and Reel; Package Quantity: 1; Weight: 0.023634oz; Voltage Rating: 16V; Width: 0.169inch; Case/Package: 2917; Mount: Surface Mount; Voltage: 16V; Min Operating Temperature: -55°C; Tolerance: 10%; REACH SVHC: No SVHC; Height - Seated (Max): 0.122inch; Number of Pins: 2; Construction: Flat; Depth: 4.3mm; Series: T495; Max Operating Temperature: 125°C; Failure Rate: 0.001%; Termination: SMD/SMT; Voltage Rating (DC): 16V; Case Code (Imperial): 2917; Case Code (Metric): 7343; Height: 2.8mm
C11 C12 = CMP-1037-04923-3: Chip Multilayer Ceramic Capacitors for General Purpose, 1206, 4.7uF, X7R, 15%, 10%, 50V; Height: 1.6mm; Voltage: 50V; Capacitance: 4.7uF; Lead Free: Lead Free; Max Operating Temperature: 125°C; Packaging: Tape and Reel; REACH SVHC: No SVHC; Voltage Rating: 50V; Mount: Surface Mount; Termination: SMD/SMT; Tolerance: 10%; Case/Package: 1206; Material: Ceramic; Depth: 1.6mm; Length: 3.2mm; Case Code (Metric): 3216; Voltage Rating (DC): 50V; Case Code (Imperial): 1206; Radiation Hardening: No; Width: 0.063inch; Thickness: 0.071inch; Package Quantity: 2000; Min Operating Temperature: -55°C; Dielectric: X7R
C37 = CMP-2000-05397-3: Multilayer Ceramic Capacitors 47uF ±20% 25V X5R SMD 1206; Weight: 0.000571oz; Dielectric: X5R; Length: 0.126inch; Voltage Rating: 25V; Case/Package: 1206; Dielectric Material: Ceramic; Min Operating Temperature: -55°C; Lead Free: Lead Free; Packaging: Tape and Reel; Package Quantity: 1; Mount: Surface Mount; Depth: 1.6mm; REACH SVHC: No SVHC; Termination: SMD/SMT; Case Code (Imperial): 1206; Series: C; Resistor Type: Ceramic; Voltage: 25V; Width: 0.063inch; Height: 1.6mm; Tolerance: 20%; Capacitance: 47uF; Max Operating Temperature: 85°C; Voltage Rating (DC): 25V; RoHS Compliant: Yes; Thickness: 0.071inch; Case Code (Metric): 3216
CR1 = MBRD10200CT-13: No Description Available; Mfr_Name: Diodes Inc; Type: Diodes - Rectifiers, Arrays; RefDes: RefDes
D23 = CMP-08607-000111-1: TVS DIODE 12V 19.9V DO214AB; Number of Channels: 1; Power Line Protection: No; Reverse Breakdown Voltage: 13.3V; Max Power Dissipation: 6.5W; Peak Pulse Current: 150.8A; Leakage Current: 2uA; Diode Type: ZENER; Power Dissipation: 3kW; Test Current: 1mA; Direction: Unidirectional; Max Breakdown Voltage: 14.7V; Lead Free: Lead Free; Packaging: Tape and Reel; Series: SMDJ; Number of Pins: 2; Resistor Type: Zener; Termination: SMD/SMT; RoHS Compliant: Yes; Number of Elements: 1; REACH SVHC: No SVHC; Min Breakdown Voltage: 13.3V; Mount: Surface Mount; Operating Supply Voltage: 12V; Polarity: Unidirectional; Breakdown Voltage: 13.3V; Max Surge Current: 150.8A; Clamping Voltage-Max: 19.9V; Clamping Voltage: 19.9V; Reverse Standoff Voltage: 12V; Max Operating Temperature: 150°C; Case/Package: DO-214AB; Package Quantity: 3000; Peak Pulse Power: 3kW; Min Operating Temperature: -55°C; Number of Unidirectional Channels: 1
F1 = FUSE_0603_2.00A: FUSE SLOW 5.00A 32V M 0603; VALENTIUM PART NUM: <VALENTIUM>; MFG NAME: BOURNS; MAXTEMP: 105C; MINTEMP: -40C; OTHER: UL E141069; P1: SLOW BLO; DESC: FUSE SLOW 1.25A 32V M 0603; MODIFY DATE: 9/4/2013; CATEGORY: FUSE; DATE: 20 OCT 15; P2: 32V; P3: M; SIZE: 0603; SHEETPART: *; Supplier 1: Digi-Key
J38 = CMP-2000-05600-2: CONN HEADER R/A 4POS 4.2MM; Manufacturer: Molex; Current Rating: 13A; Voltage Rating: 600V; Number Of Contacts: 4; Standoff Height: 0.4mm; Conn Orientation: Right Angle; Conn Gender: Male; Device Class L1: Connectors; Pitch: 4.2mm; Package: 39-30-0040; Octopart: https://octopart.com/39-30-0040-molex-277428; Mouser Description: Headers & Wire Housings 4 CKT R/A HEADER; Temperature Range High: +105°C; Number Of Rows: 2; ComponentLink2Description: Datasheet; ComponentLink2URL: https://www.molex.com/webdocs/datasheets/pdf/en-us/0039300040_PCB_HEADERS.pdf; Manufacturer Part Number: 39-30-0040; Contact Material: Gold,Nickel; Digikey Description: CONN HEADER R/A 4POS 4.2MM; Temperature: -40°C to +105°C; Automotive: No; Device Class L2: Headers and Wire Housings; RoHS: TRUE; Lead Free: Yes; Device Class L3: unset; Category: Conn; Footprint Url: https://www.molex.com/pdm_docs/sd/039300040_sd.pdf; Temperature Range Low: -40°C
R7 = CMP-2003-04334-1: Manufacturer: Vishay Dale; Part Number: WSL12062L000FEA18
R44 = CMP-2003-04873-1: Part Number: CRCW12060000Z0EAHP; Manufacturer: Vishay Dale

## Sheet 05-Front Panel SFP+.SchDoc
size Tabloid; Customer: 01910; SheetNumber: 5; SheetTotal: 22
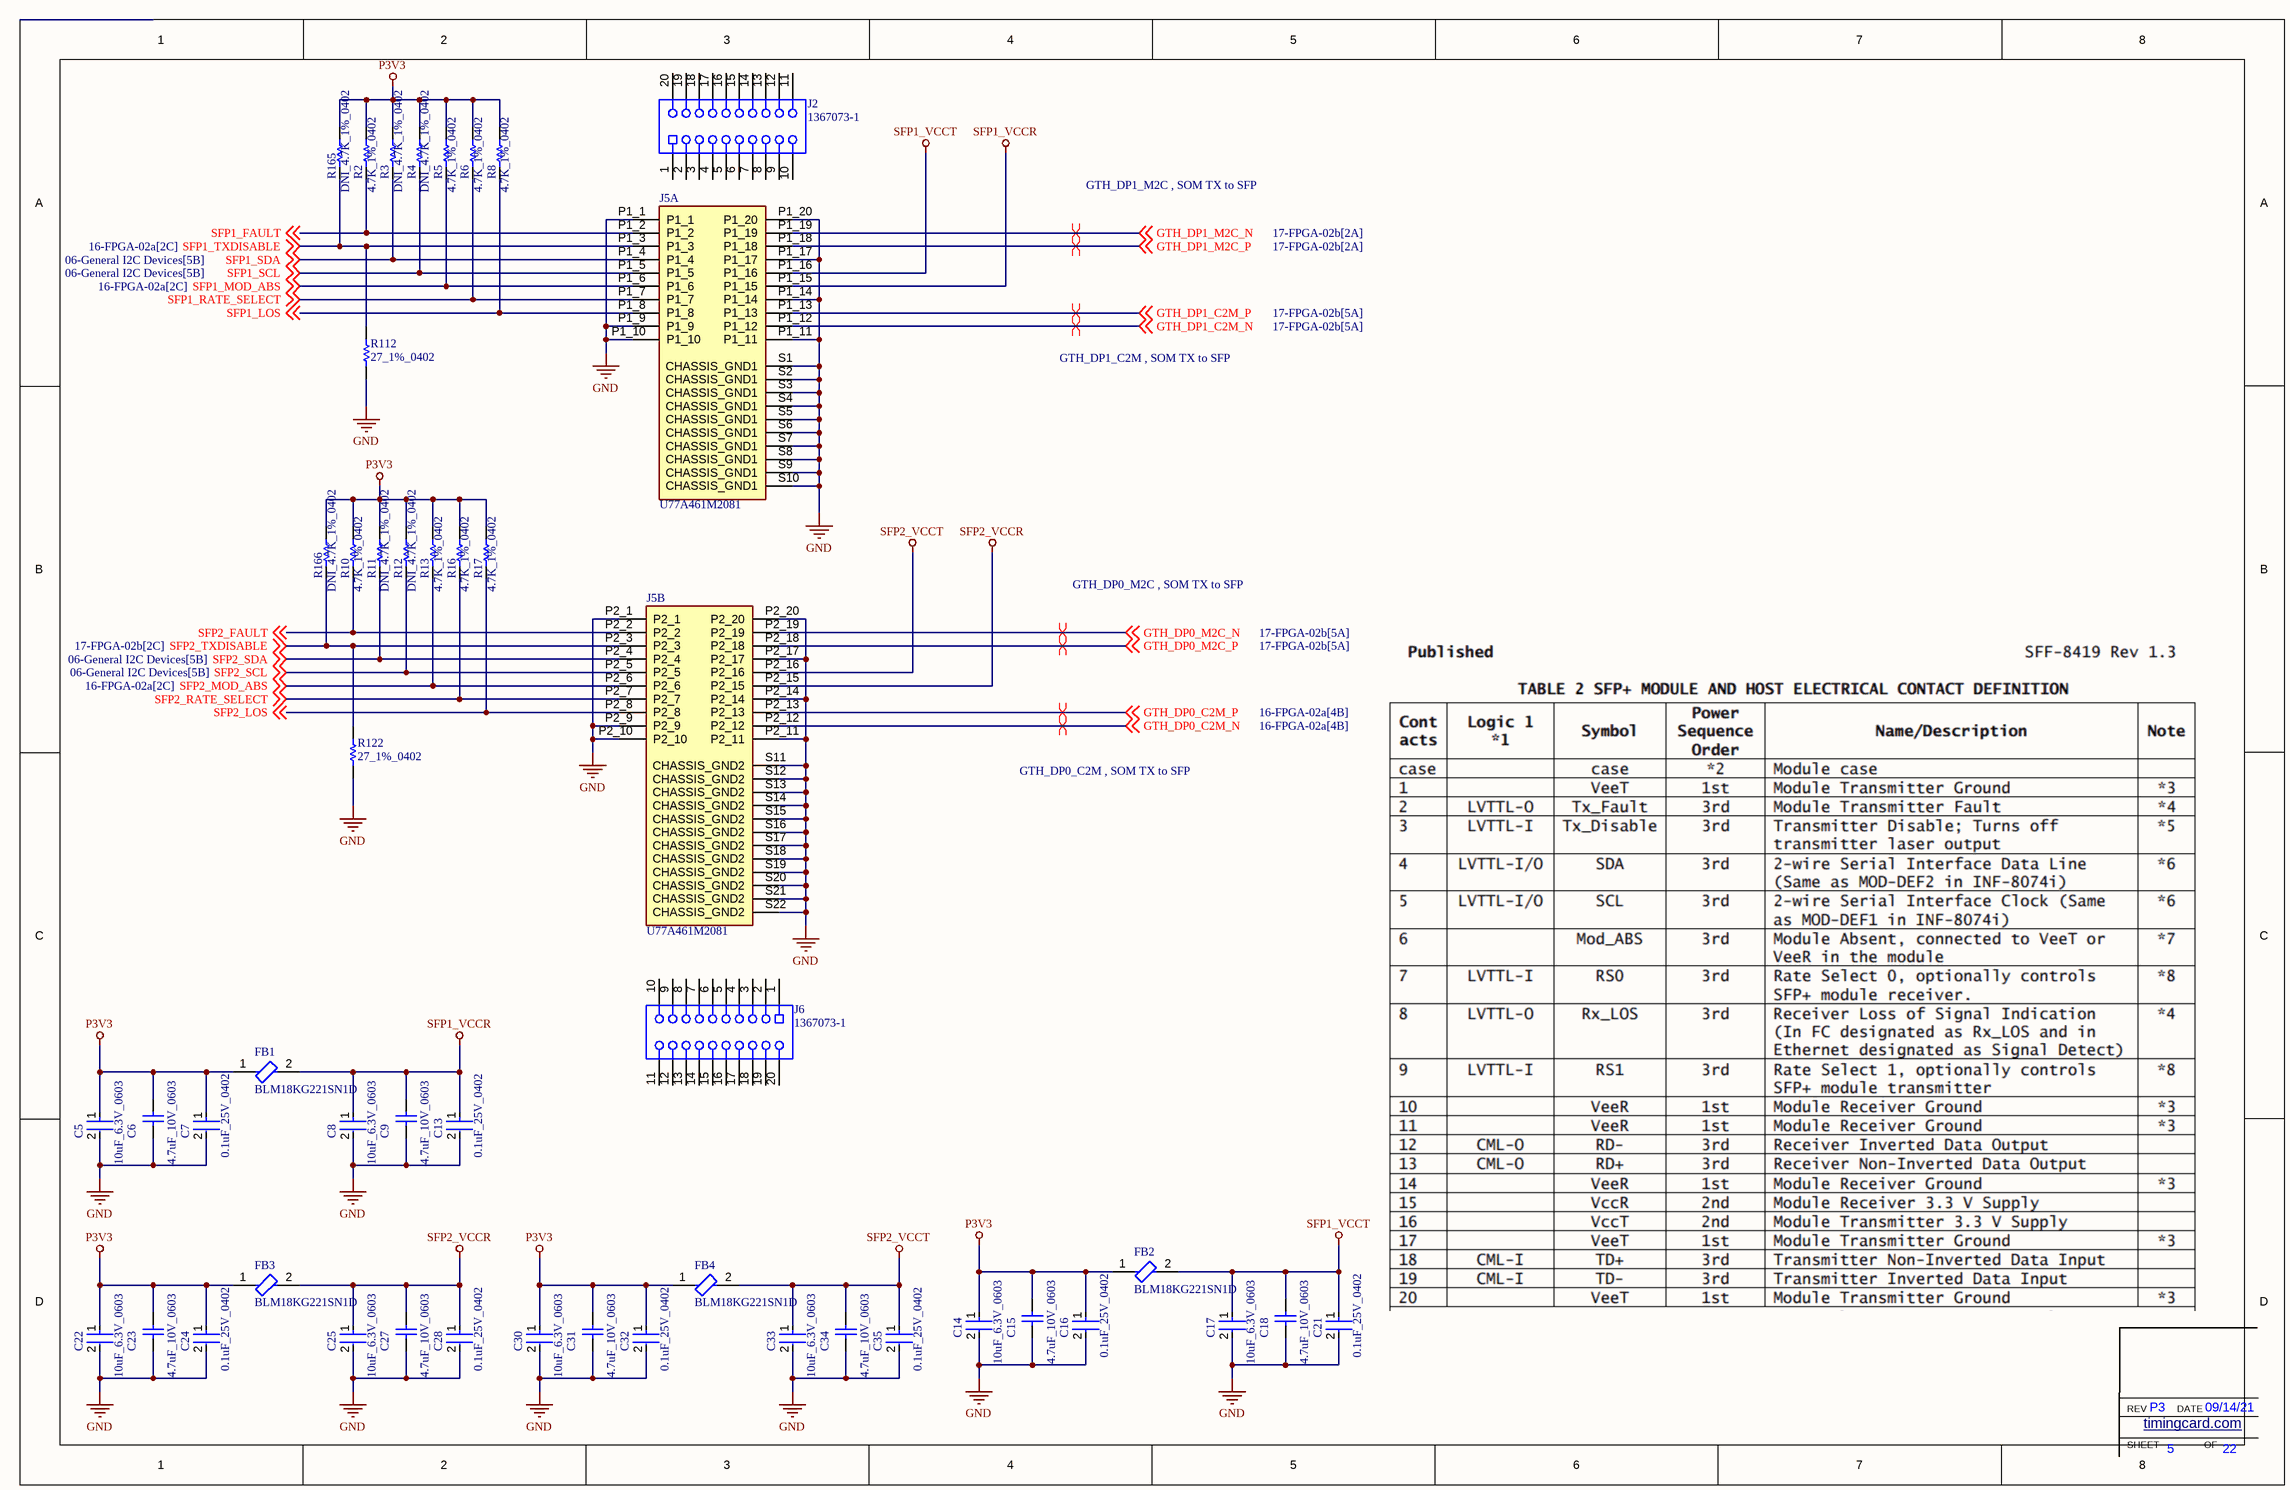
[diagram p4: 05-Front Panel SFP+.SchDoc]

### Parts
C5  10uF_6.3V_0603  [FP-C0603C106M9PACTU-MFG]
C6  4.7uF_10V_0603  [CAPC1608X87X35NL15T15]
C7  0.1uF_25V_0402  [FP-0402-L_1_0_1-W_0_5_0_1-IPC_C]
C8  10uF_6.3V_0603  [FP-C0603C106M9PACTU-MFG]
C9  4.7uF_10V_0603  [CAPC1608X87X35NL15T15]
C13  0.1uF_25V_0402  [FP-0402-L_1_0_1-W_0_5_0_1-IPC_C]
C14  10uF_6.3V_0603  [FP-C0603C106M9PACTU-MFG]
C15  4.7uF_10V_0603  [CAPC1608X87X35NL15T15]
C16  0.1uF_25V_0402  [FP-0402-L_1_0_1-W_0_5_0_1-IPC_C]
C17  10uF_6.3V_0603  [FP-C0603C106M9PACTU-MFG]
C18  4.7uF_10V_0603  [CAPC1608X87X35NL15T15]
C21  0.1uF_25V_0402  [FP-0402-L_1_0_1-W_0_5_0_1-IPC_C]
C22  10uF_6.3V_0603  [FP-C0603C106M9PACTU-MFG]
C23  4.7uF_10V_0603  [CAPC1608X87X35NL15T15]
C24  0.1uF_25V_0402  [FP-0402-L_1_0_1-W_0_5_0_1-IPC_C]
C25  10uF_6.3V_0603  [FP-C0603C106M9PACTU-MFG]
C27  4.7uF_10V_0603  [CAPC1608X87X35NL15T15]
C28  0.1uF_25V_0402  [FP-0402-L_1_0_1-W_0_5_0_1-IPC_C]
C30  10uF_6.3V_0603  [FP-C0603C106M9PACTU-MFG]
C31  4.7uF_10V_0603  [CAPC1608X87X35NL15T15]
C32  0.1uF_25V_0402  [FP-0402-L_1_0_1-W_0_5_0_1-IPC_C]
C33  10uF_6.3V_0603  [FP-C0603C106M9PACTU-MFG]
C34  4.7uF_10V_0603  [CAPC1608X87X35NL15T15]
C35  0.1uF_25V_0402  [FP-0402-L_1_0_1-W_0_5_0_1-IPC_C]
FB1  BLM18KG221SN1D  [FP-BLM18-0_15-t0_8-IPC_B]
FB2  BLM18KG221SN1D  [FP-BLM18-0_15-t0_8-IPC_B]
FB3  BLM18KG221SN1D  [FP-BLM18-0_15-t0_8-IPC_B]
FB4  BLM18KG221SN1D  [FP-BLM18-0_15-t0_8-IPC_B]
J2  1367073-1  [TECO-1367073-1_V]
J5  U77A461M2081  [AMPHENOL_U77A461M2081]  (parts A,B of 4)
J6  1367073-1  [TECO-1367073-1_V]
R2  4.7K_1%_0402  [RESC1005X40X25NL10T10]
R3  DNI_4.7K_1%_0402  [RESC1005X40X25NL10T10]  (no BOM)
R4  DNI_4.7K_1%_0402  [RESC1005X40X25NL10T10]  (no BOM)
R5  4.7K_1%_0402  [RESC1005X40X25NL10T10]
R6  4.7K_1%_0402  [RESC1005X40X25NL10T10]
R8  4.7K_1%_0402  [RESC1005X40X25NL10T10]
R10  4.7K_1%_0402  [RESC1005X40X25NL10T10]
R11  DNI_4.7K_1%_0402  [RESC1005X40X25NL10T10]  (no BOM)
R12  DNI_4.7K_1%_0402  [RESC1005X40X25NL10T10]  (no BOM)
R13  4.7K_1%_0402  [RESC1005X40X25NL10T10]
R16  4.7K_1%_0402  [RESC1005X40X25NL10T10]
R17  4.7K_1%_0402  [RESC1005X40X25NL10T10]
R112  27_1%_0402  [RESC1005X40X25NL05T05]
R122  27_1%_0402  [RESC1005X40X25NL05T05]
R165  DNI_4.7K_1%_0402  [RESC1005X40X25NL10T10]  (no BOM)
R166  DNI_4.7K_1%_0402  [RESC1005X40X25NL10T10]  (no BOM)

### Nets
GND: C5.2 C6.1 C7.2 C8.2 C9.1 C13.2 C14.2 C15.1 C16.2 C17.2 C18.1 C21.2 C22.2 C23.1 C24.2 C25.2 C27.1 C28.2 C30.2 C31.1 C32.2 C33.2 C34.1 C35.2 J5.P1_1 J5.P1_9 J5.P1_10 J5.P1_11 J5.P1_14 J5.P1_17 J5.P1_20 J5.P2_1 J5.P2_9 J5.P2_10 J5.P2_11 J5.P2_14 J5.P2_17 J5.P2_20 J5.S1(CHASSIS_GND1) J5.S2(CHASSIS_GND1) J5.S3(CHASSIS_GND1) J5.S4(CHASSIS_GND1) J5.S5(CHASSIS_GND1) J5.S6(CHASSIS_GND1) J5.S7(CHASSIS_GND1) J5.S8(CHASSIS_GND1) J5.S9(CHASSIS_GND1) J5.S10(CHASSIS_GND1) J5.S11(CHASSIS_GND2) J5.S12(CHASSIS_GND2) J5.S13(CHASSIS_GND2) J5.S14(CHASSIS_GND2) J5.S15(CHASSIS_GND2) J5.S16(CHASSIS_GND2) J5.S17(CHASSIS_GND2) J5.S18(CHASSIS_GND2) J5.S19(CHASSIS_GND2) J5.S20(CHASSIS_GND2) J5.S21(CHASSIS_GND2) J5.S22(CHASSIS_GND2) R112.1 R122.1
P3V3: C5.1 C6.2 C7.1 C14.1 C15.2 C16.1 C22.1 C23.2 C24.1 C30.1 C31.2 C32.1 FB1.1 FB2.1 FB3.1 FB4.1 R2.1 R3.1 R4.1 R5.1 R6.1 R8.1 R10.1 R11.1 R12.1 R13.1 R16.1 R17.1 R165.1 R166.1
SFP1_VCCR: C8.1 C9.2 C13.1 FB1.2 J5.P1_15
SFP1_VCCT: C17.1 C18.2 C21.1 FB2.2 J5.P1_16
SFP2_VCCR: C25.1 C27.2 C28.1 FB3.2 J5.P2_15
SFP2_VCCT: C33.1 C34.2 C35.1 FB4.2 J5.P2_16
GTH_DP0_C2M_N: J5.P2_12 ; off-sheet GTH_DP0_C2M_N
GTH_DP0_C2M_P: J5.P2_13 ; off-sheet GTH_DP0_C2M_P
GTH_DP0_M2C_N: J5.P2_19 ; off-sheet GTH_DP0_M2C_N
GTH_DP0_M2C_P: J5.P2_18 ; off-sheet GTH_DP0_M2C_P
GTH_DP1_C2M_N: J5.P1_12 ; off-sheet GTH_DP1_C2M_N
GTH_DP1_C2M_P: J5.P1_13 ; off-sheet GTH_DP1_C2M_P
GTH_DP1_M2C_N: J5.P1_19 ; off-sheet GTH_DP1_M2C_N
GTH_DP1_M2C_P: J5.P1_18 ; off-sheet GTH_DP1_M2C_P
SFP1_FAULT: J5.P1_2 R2.2 ; off-sheet SFP1_FAULT
SFP1_LOS: J5.P1_8 R8.2 ; off-sheet SFP1_LOS
SFP1_MOD_ABS: J5.P1_6 R5.2 ; off-sheet SFP1_MOD_ABS
SFP1_RATE_SELECT: J5.P1_7 R6.2 ; off-sheet SFP1_RATE_SELECT
SFP1_SCL: J5.P1_5 R4.2 ; off-sheet SFP1_SCL
SFP1_SDA: J5.P1_4 R3.2 ; off-sheet SFP1_SDA
SFP1_TXDISABLE: J5.P1_3 R112.2 R165.2 ; off-sheet SFP1_TXDISABLE
SFP2_FAULT: J5.P2_2 R10.2 ; off-sheet SFP2_FAULT
SFP2_LOS: J5.P2_8 R17.2 ; off-sheet SFP2_LOS
SFP2_MOD_ABS: J5.P2_6 R13.2 ; off-sheet SFP2_MOD_ABS
SFP2_RATE_SELECT: J5.P2_7 R16.2 ; off-sheet SFP2_RATE_SELECT
SFP2_SCL: J5.P2_5 R12.2 ; off-sheet SFP2_SCL
SFP2_SDA: J5.P2_4 R11.2 ; off-sheet SFP2_SDA
SFP2_TXDISABLE: J5.P2_3 R122.2 R166.2 ; off-sheet SFP2_TXDISABLE

Not connected (* = marked no-connect by the designer): J2 1 2 3 4 5 6 7 8 9 10 11 12 13 14 15 16 17 18 19 20; J6 1 2 3 4 5 6 7 8 9 10 11 12 13 14 15 16 17 18 19 20

### Layout directives
differential pair: GTH_DP0_C2M_N, GTH_DP0_C2M_P, GTH_DP0_M2C_N, GTH_DP0_M2C_P, GTH_DP1_C2M_N, GTH_DP1_C2M_P, GTH_DP1_M2C_N, GTH_DP1_M2C_P

### Notes on the sheet
- GTH_DP1_M2C , SOM TX to SFP
- GTH_DP1_C2M , SOM TX to SFP
- GTH_DP0_M2C , SOM TX to SFP
- GTH_DP0_C2M , SOM TX to SFP
- SHEET
- REV
- timingcard.com <http://timingcard.com>
- DATE
- OF

### Library data of the parts
C5 C8 C14 C17 C22 C25 C30 C33 = CMP-2006-02285-3: CAP CER 10UF 6.3V X5R 0603; Manufacturer Part Number: C0603C106M9PACTU; Manufacturer: Kemet; Material: Ceramic; Temperature Coefficient: 15%; Tolerance: 20%; Category: Cap; Height: 0.9mm; Digikey Description: CAP CER 10UF 6.3V X5R 0603; Mouser Description: In a Pack of 10, KEMET 0603 (1608M) 10µF MLCC 6.3V dc ±20% SMD C0603C106M9PACTU; Voltage Rating: 6.3V; Device Class L2: Capacitors; Temperature Range Low: -55°C; Temperature Characteristic: X5R; ComponentLink2Description: Datasheet; Ipc Land Pattern Name: CAPC16080X80; ComponentLink2URL: http://www.kemet.com/Lists/ProductCatalog/Attachments/19/KEM_C1006_X5R_SMD.pdf; Capacitance: 10uF; Temperature Range High: +85°C; Device Class L3: Ceramic Capacitors; RoHS: TRUE; Automotive: No; Value: 10uF; Temperature: -55°C to +85°C; Device Class L1: Passive Components; Package: C0603C106M9PACTU; Lead Free: Yes; Octopart: https://octopart.com/c0603c106m9pactu-kemet-8375727
C6 C9 C15 C18 C23 C27 C31 C34 = CMP-2006-03238-1: Part Number: C0603C475K8PACTU; Manufacturer: Kemet
C7 C13 C16 C21 C24 C28 C32 C35 = CMP-2008-02519-2: as C19 on sheet 01-PCIe; Package Quantity: 1; Capacitance: 100nF; Min Operating Temperature: -55°C; Voltage: 25V; Voltage Rating: 25V; Construction: Flat; Max Operating Temperature: 125°C; Radiation Hardening: No; Depth: 0.5mm; Thickness: 0.022inch; Voltage Rating (DC): 25V; Number of Pins: 2; Lead Free: Lead Free; Series: -; REACH SVHC: No SVHC; Length: 1mm; Dielectric: X7R; RoHS Compliant: Yes; Mount: Surface Mount; Packaging: Tape and Reel; Case/Package: 0402; Case Code (Imperial): 0402; Termination: SMD/SMT; Width: 0.02inch; Case Code (Metric): 1005; Tolerance: 10%
FB1-FB4 = CMP-0686-00556-7: Chip Ferrite Bead, 0603, 220Ω @ 100MHz, 0.05Ω, 25%, 2.2A; DC Resistance (DCR): 50mR; Number of Circuits: 1; Impedance: 220R; Current Rating: 2.2A; Material: Ferrite; Test Frequency: 100MHz; Depth: 0.8mm; Series: BLM18K; RoHS Compliant: Yes; Termination: SMD/SMT; Max Current Rating: 2.2A; Case Code (Metric): 1608; Radiation Hardening: No; Number of Pins: 2; Length: 1.6mm; Lead Free: Lead Free; Package Quantity: 1; Height: 0.8mm; Core Material: Ferrite; Inductor Type: FERRITE BEAD; Min Operating Temperature: -55°C; Case/Package: 0603; Case Code (Imperial): 0603; Number of Lines: 1; Packaging: Tape and Reel; REACH SVHC: No SVHC; Max Operating Temperature: 125°C; Military Standard: Not; DC Resistance-Max: 50mR; Width: 0.8mm; DC Current: 2.2A; Max DC Current: 2.2A; Tolerance: 25%; Weight: 7.1E-05oz
J2 J6 = CMP-2000-05488-1: Female Connector, Pitch 0.8 mm, 2 x 10 Position, Height 5.4 mm, -55 to 85 degC, RoHS, Tape and Reel; Manufacturer: TE Connectivity; Product Training Modules: HighSpeedPluggableI/OSolutions; 3D Model: 1367073-1.pdf; Connector Type: SFP; Other Names: A97430DKR; Mating Products: 516-2084-ND / -TXRXOPTICALSFF1.25GBDISCSI; Dynamic Catalog: SFPConnectors; Featured Product: HighSpeedPluggableI-OSolutions; Connector Style: Receptacle; Associated Product: A103997CT-ND / -CONNSFPCAGESINGLEW/OPIPE / A103997TR-ND / -CONNSFPCAGESINGLEW/OPIPE / 1367645-3-ND / -CONNCAGE&HEATSINKSGLPORTTIN / 1367645-2-ND / -CONNCAGE&HEATSINKSGLPORTTIN / 1888424-1-ND / -CONNCAGE1X2SFPENHANCEDEMI / 1367643-1-ND / -CONNCAGESNGLPORTDBLSIDETIN / 1489962-1-ND / -CONNSFPCAGESINGLEW/OPIPE / 1367645-1-ND / -CONNCAGE&HEATSINKSGLPORTTIN / A99375-ND / -CONNSFPCAGE1X4PIN-IN-PASTE / A97412CT-ND / -CONNSFPLOWERCAGEPCB / More...; Number of Positions: 20; Package Reference: 1367073-1; Package Description: Female Connector, Pitch 0.8 mm, 2 x 10 Position, Height 5.4 mm; RoHS Information: 1367073-1StatementofCompliance; Contact Finish: Gold; Datasheet URL: http://www.te.com/commerce/DocumentDelivery/DDEController?Action=showdoc&DocId=Customer+Drawing%7F1367073%7FK%7Fpdf%7FEnglish%7FENG_CD_1367073_K.pdf%7F1367073-1; Datasheet Version: Rev. K, 12/2012; Contact Finish Thickness: 15µin(0.38µm); Category: Connectors,Interconnects; Mounting Type: SurfaceMount,RightAngle; Mounting Technology: SurfaceMount; Packaging: Digi-Reel®; Manufacturer URL: http://www.te.com/; Family: PluggableConnectors; Standard Package: 1; Termination: Solder
J5 = U77A461M2081: MF: AMPHENOL ICC / FCI; Package: None; Price: None; Value: *; MP: U77A461M2081; Availability: Unavailable
R2-R6 R8 R10-R13 R16 R17 R165 R166 = CMP-2002-05217-1: as R18 on sheet 01-PCIe
R112 R122 = CMP-2002-08434-1: Part Number: CRCW040227R0FKED; Manufacturer: Vishay Dale